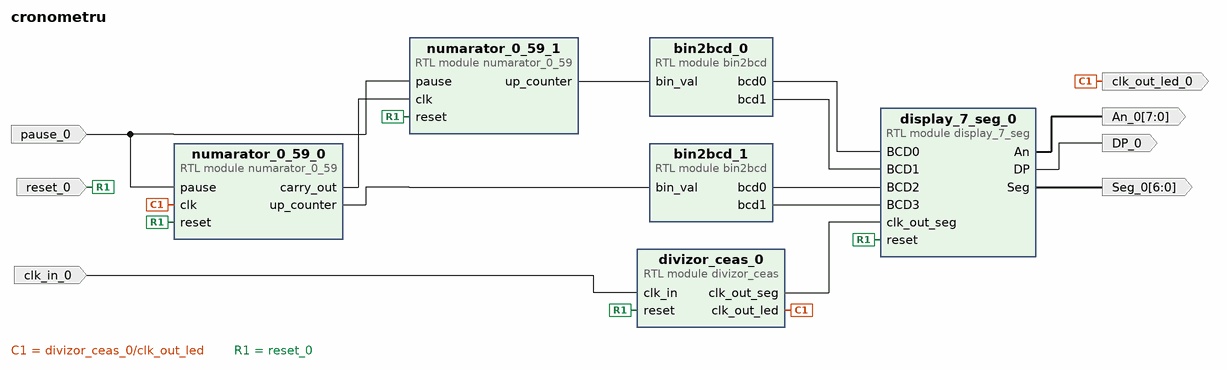
[diagram p0: block diagram of the top level]
# Vivado block design cronometru, xc7a100tcsg324-1, Vivado 2019.2
create_bd_design cronometru

create_bd_port -dir O -from 7 -to 0 An_0
create_bd_port -dir O DP_0
create_bd_port -dir O -from 6 -to 0 Seg_0
create_bd_port -dir I clk_in_0
create_bd_port -dir O clk_out_led_0
create_bd_port -dir I pause_0
create_bd_port -dir I -type rst reset_0

create_bd_cell -type module -reference numarator_0_59 numarator_0_59_1
create_bd_cell -type module -reference bin2bcd bin2bcd_0
create_bd_cell -type module -reference bin2bcd bin2bcd_1
create_bd_cell -type module -reference divizor_ceas divizor_ceas_0
create_bd_cell -type module -reference display_7_seg display_7_seg_0
create_bd_cell -type module -reference numarator_0_59 numarator_0_59_0

# ---- connections ----

connect_bd_net [get_bd_pins numarator_0_59_1/up_counter] [get_bd_pins bin2bcd_0/bin_val]
connect_bd_net [get_bd_pins bin2bcd_1/bcd0] [get_bd_pins display_7_seg_0/BCD2]
connect_bd_net [get_bd_pins bin2bcd_1/bcd1] [get_bd_pins display_7_seg_0/BCD3]
connect_bd_net [get_bd_pins bin2bcd_0/bcd0] [get_bd_pins display_7_seg_0/BCD0]
connect_bd_net [get_bd_pins bin2bcd_0/bcd1] [get_bd_pins display_7_seg_0/BCD1]
connect_bd_net [get_bd_pins divizor_ceas_0/clk_out_seg] [get_bd_pins display_7_seg_0/clk_out_seg]
connect_bd_net [get_bd_pins display_7_seg_0/An] [get_bd_ports An_0]
connect_bd_net [get_bd_pins display_7_seg_0/DP] [get_bd_ports DP_0]
connect_bd_net [get_bd_pins display_7_seg_0/Seg] [get_bd_ports Seg_0]
connect_bd_net -net clk_in_0_1 [get_bd_ports clk_in_0] [get_bd_pins divizor_ceas_0/clk_in]
connect_bd_net [get_bd_pins divizor_ceas_0/clk_out_led] [get_bd_ports clk_out_led_0] [get_bd_pins numarator_0_59_0/clk]
connect_bd_net [get_bd_pins numarator_0_59_0/up_counter] [get_bd_pins bin2bcd_1/bin_val]
connect_bd_net [get_bd_pins numarator_0_59_0/carry_out] [get_bd_pins numarator_0_59_1/clk]
connect_bd_net -net pause_0_1 [get_bd_ports pause_0] [get_bd_pins numarator_0_59_0/pause] [get_bd_pins numarator_0_59_1/pause]
connect_bd_net -net reset_0_1 [get_bd_ports reset_0] \
  [get_bd_pins numarator_0_59_0/reset] [get_bd_pins numarator_0_59_1/reset] [get_bd_pins divizor_ceas_0/reset] \
  [get_bd_pins display_7_seg_0/reset]

validate_bd_design
save_bd_design
